# Altium schematic sheet Board_C22.SchDoc: Chicken Board C22
size A3; Organization: Pay It Forward club; Address2: 304B1; Address4: HCMUT; DocumentNumber: 1; Revision: 3; SheetNumber: 1; SheetTotal: 1
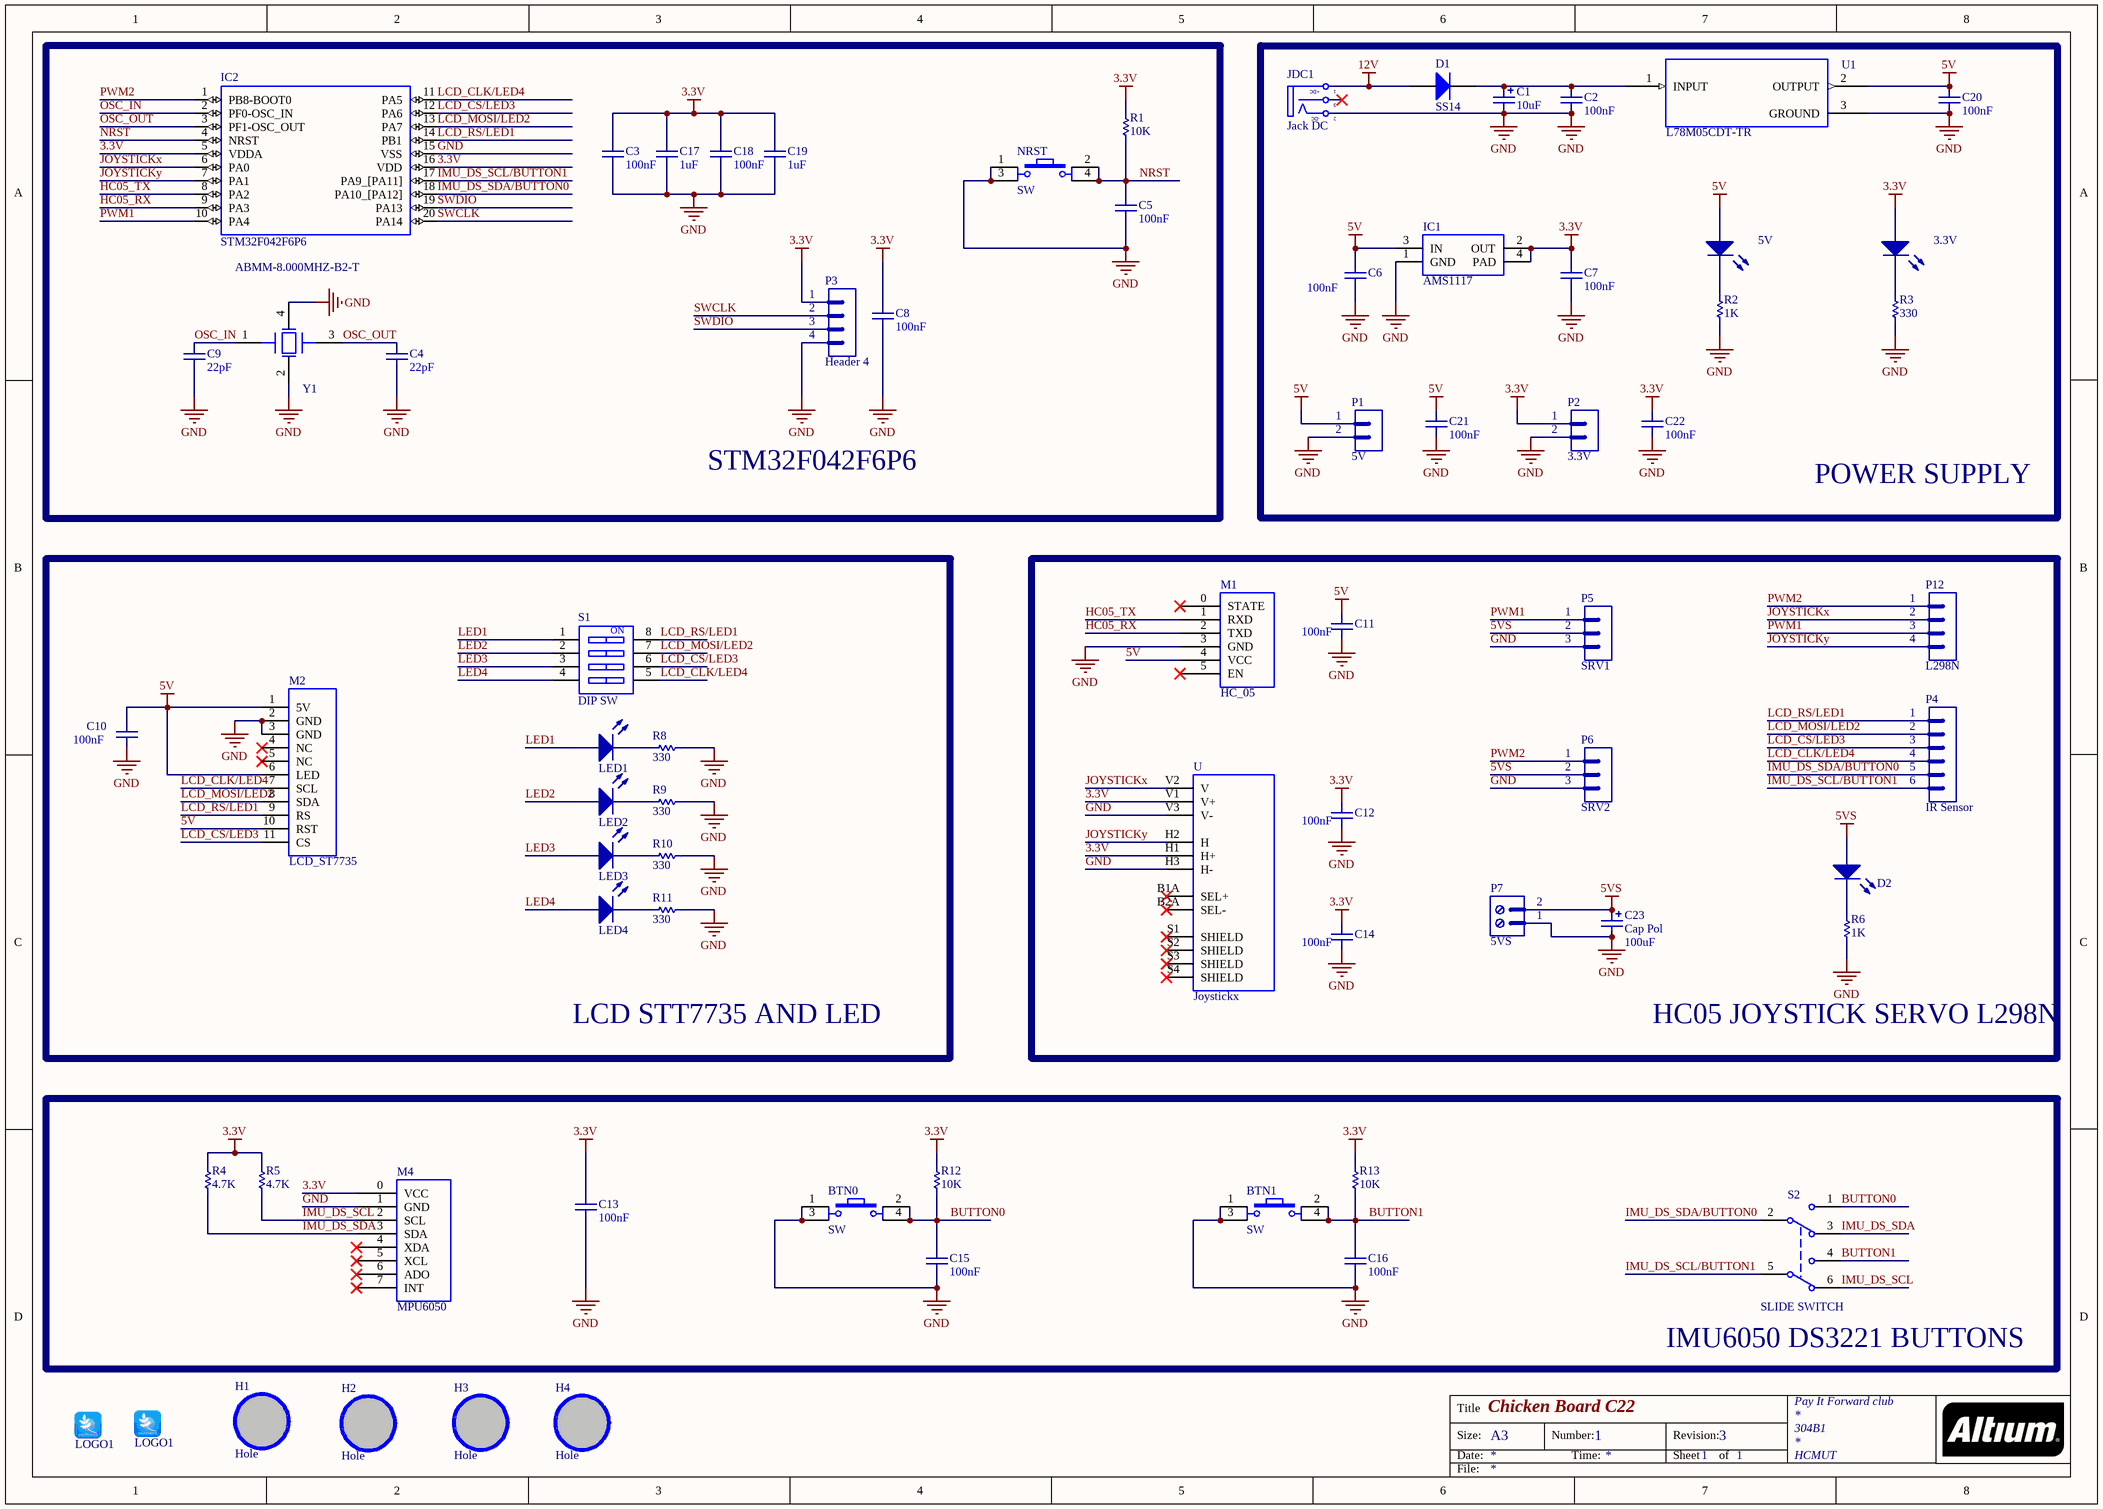
[diagram p0: Board_C22.SchDoc]

## Parts
(Parts that share a designator on the sheet are numbered #1, #2 ... from top to bottom, then left to right.)
3.3V  LED  [LED_0805_Blue]  (value not drawn)
5V  LED  [LED_0805_Blue]  (value not drawn)
BTN0  SW  [4301x60437x6]
BTN1  SW  [4301x60437x6]
C1  Capacitance: 10uF  [C_TANTALUM_3216_18]  (hidden comment: Capacitors)
C2  value 100nF  [CAP-SM-0805]  (hidden comment: Cap Non-Pol SMD)
C3  value 100nF  [CAP-SM-0805]  (hidden comment: Cap Non-Pol SMD)
C4  value 22pF  [CAP-SM-0805]  (hidden comment: Cap Non-Pol SMD)
C5  value 100nF  [CAP-SM-0805]  (hidden comment: Cap Non-Pol SMD)
C6  value 100nF  [CAP-SM-0805]  (hidden comment: Cap Non-Pol SMD)
C7  value 100nF  [CAP-SM-0805]  (hidden comment: Cap Non-Pol SMD)
C8  value 100nF  [CAP-SM-0805]  (hidden comment: Cap Non-Pol SMD)
C9  value 22pF  [CAP-SM-0805]  (hidden comment: Cap Non-Pol SMD)
C10  value 100nF  [CAP-SM-0805]  (hidden comment: Cap Non-Pol SMD)
C11  value 100nF  [CAP-SM-0805]  (hidden comment: Cap Non-Pol SMD)
C12  value 100nF  [CAP-SM-0805]  (hidden comment: Cap Non-Pol SMD)
C13  value 100nF  [CAP-SM-0805]  (hidden comment: Cap Non-Pol SMD)
C14  value 100nF  [CAP-SM-0805]  (hidden comment: Cap Non-Pol SMD)
C15  value 100nF  [CAP-SM-0805]  (hidden comment: Cap Non-Pol SMD)
C16  value 100nF  [CAP-SM-0805]  (hidden comment: Cap Non-Pol SMD)
C17  value 1uF  [CAP-SM-0805]  (hidden comment: Cap Non-Pol SMD)
C18  value 100nF  [CAP-SM-0805]  (hidden comment: Cap Non-Pol SMD)
C19  value 1uF  [CAP-SM-0805]  (hidden comment: Cap Non-Pol SMD)
C20  value 100nF  [CAP-SM-0805]  (hidden comment: Cap Non-Pol SMD)
C21  value 100nF  [CAP-SM-0805]  (hidden comment: Cap Non-Pol SMD)
C22  value 100nF  [CAP-SM-0805]  (hidden comment: Cap Non-Pol SMD)
C23  Cap Pol  value 100uF  [CP1/2.5]
D1  SS14  [SS14]
D2  LED  [LED_0805_Blue]  (value not drawn)
H1  Hole  [LO KHOAN 3MM]
H2  Hole  [LO KHOAN 3MM]
H3  Hole  [LO KHOAN 3MM]
H4  Hole  [LO KHOAN 3MM]
IC1  AMS1117  [SOT223]
IC2  STM32F042F6P6  [TSSOP20]
JDC1  Jack DC  [DC-IN]
LED1  LED  [LED_0805_Blue]  (value not drawn)
LED2  LED  [LED_0805_Blue]  (value not drawn)
LED3  LED  [LED_0805_Blue]  (value not drawn)
LED4  LED  [LED_0805_Blue]  (value not drawn)
LOGO1#1  LOGO PIF  [PIF LOGO TOP OVERLAY]  (value not drawn)
LOGO1#2  LOGO PIF  [PIF LOGO BOTTOM OVERLAY]  (value not drawn)
M1  HC_05  [HC_05]
M2  LCD_ST7735  [LCD_ST7735]
M4  MPU6050  [GY521_MPU6050]
NRST  SW  [4301x60437x6]
P1  5V  [JP2]
P2  3.3V  [JP2]
P3  Header 4  [JP4]
P4  IR Sensor  [JP6]
P5  SRV1  [JP3]
P6  SRV2  [JP3]
P7  5VS  [DOMINO SMALL 2]
P12  L298N  [JP4]
R1  value 10K  [RES-SM-0805]  (hidden comment: Resistor 1/4W)
R2  value 1K  [RES-SM-0805]  (hidden comment: Resistor 1/4W)
R3  value 330  [RES-SM-0805]  (hidden comment: Resistor 1/4W)
R4  value 4.7K  [RES-SM-0805]  (hidden comment: Resistor 1/4W)
R5  value 4.7K  [RES-SM-0805]  (hidden comment: Resistor 1/4W)
R6  value 1K  [RES-SM-0805]  (hidden comment: Resistor 1/4W)
R8  value 330  [RES-SM-0805]  (hidden comment: Resistor 1/4W)
R9  value 330  [RES-SM-0805]  (hidden comment: Resistor 1/4W)
R10  value 330  [RES-SM-0805]  (hidden comment: Resistor 1/4W)
R11  value 330  [RES-SM-0805]  (hidden comment: Resistor 1/4W)
R12  value 10K  [RES-SM-0805]  (hidden comment: Resistor 1/4W)
R13  value 10K  [RES-SM-0805]  (hidden comment: Resistor 1/4W)
S1  DIP SW  [418117270904]
S2  SLIDE SWITCH  [452404020202]
U  Joystickx  [XDCR_COM-09032]
U1  L78M05CDT-TR  [DPAK_STM]
Y1  ABMM-8.000MHZ-B2-T  [XTAL_TSX-3225_16.0000MF18X-AC3]

## Nets
3.3V: 3.3V.1(A) C3.2 C7.2 C8.2 C12.2 C13.2 C14.2 C17.2 C18.2 C19.2 C22.2 IC1.2(OUT) IC1.4(PAD) IC2.5(VDDA) IC2.16(VDD) M4.0(VCC) P2.1 P3.1 R1.2 R4.2 R5.2 R12.2 R13.2 U.H1(H+) U.V1(V+)
5V: 5V.1(A) C6.2 C10.2 C11.2 C20.1 C21.2 IC1.3(IN) M1.4(VCC) M2.1(5V) M2.6(LED) M2.10(RST) P1.1 U1.2(OUTPUT)
5VS: C23.1 D2.1(A) P5.2 P6.2 P7.2
12V: D1.1(A) JDC1.1(T)
GND: BTN0.1 BTN0.3 BTN1.1 BTN1.3 C1.2 C2.1 C3.1 C4.1 C5.1 C6.1 C7.1 C8.1 C9.2 C10.1 C11.1 C12.1 C13.1 C14.1 C15.1 C16.1 C17.1 C18.1 C19.1 C20.2 C21.1 C22.1 C23.2 IC1.1(GND) IC2.15(VSS) JDC1.2(TN) M1.3(GND) M2.2(GND) M2.3(GND) M4.1(GND) NRST.1 NRST.3 P1.2 P2.2 P3.4 P5.3 P6.3 P7.1 R2.1 R3.1 R6.1 R8.1 R9.1 R10.1 R11.1 U.H3(H-) U.V3(V-) U1.3(GROUND) Y1.2 Y1.4
BUTTON0: BTN0.2 BTN0.4 C15.2 R12.1 S2.1
BUTTON1: BTN1.2 BTN1.4 C16.2 R13.1 S2.4
HC05_RX: IC2.9(PA3) M1.2(TXD)
HC05_TX: IC2.8(PA2) M1.1(RXD)
IMU_DS_SCL: M4.2(SCL) R5.1 S2.6
IMU_DS_SCL/BUTTON1: IC2.17(PA9_[PA11]) P4.6 S2.5(COM)
IMU_DS_SDA: M4.3(SDA) R4.1 S2.3
IMU_DS_SDA/BUTTON0: IC2.18(PA10_[PA12]) P4.5 S2.2(COM)
JOYSTICKx: IC2.6(PA0) P12.2 U.V2(V)
JOYSTICKy: IC2.7(PA1) P12.4 U.H2(H)
LCD_CLK/LED4: IC2.11(PA5) M2.7(SCL) P4.4 S1.5
LCD_CS/LED3: IC2.12(PA6) M2.11(CS) P4.3 S1.6
LCD_MOSI/LED2: IC2.13(PA7) M2.8(SDA) P4.2 S1.7
LCD_RS/LED1: IC2.14(PB1) M2.9(RS) P4.1 S1.8
LED1: LED1.1(A) S1.1
LED2: LED2.1(A) S1.2
LED3: LED3.1(A) S1.3
LED4: LED4.1(A) S1.4
NRST: C5.2 IC2.4(NRST) NRST.2 NRST.4 R1.1
OSC_IN: C9.1 IC2.2(PF0-OSC_IN) Y1.1
OSC_OUT: C4.2 IC2.3(PF1-OSC_OUT) Y1.3
PWM1: IC2.10(PA4) P5.1 P12.3
PWM2: IC2.1(PB8-BOOT0) P6.1 P12.1
SWCLK: IC2.20(PA14) P3.2
SWDIO: IC2.19(PA13) P3.3
Net3.3V_2: 3.3V.2(K) R3.2
Net5V_2: 5V.2(K) R2.2
NetC1_1: C1.1 C2.2 D1.2(K) U1.1(INPUT)
NetD2_2: D2.2(K) R6.2
NetLED1_2: LED1.2(K) R8.2
NetLED2_2: LED2.2(K) R9.2
NetLED3_2: LED3.2(K) R10.2
NetLED4_2: LED4.2(K) R11.2

Not connected (* = marked no-connect by the designer): H1 1; H2 1; H3 1; H4 1; JDC1 3(S)*; M1 0(STATE)* 5(EN)*; M2 4(NC)* 5(NC)*; M4 4(XDA)* 5(XCL)* 6(ADO)* 7(INT)*; U B1A(SEL+)* B2A(SEL-)* S1(SHIELD)* S2(SHIELD)* S3(SHIELD)* S4(SHIELD)*

## Notes on the sheet
- STM32F042F6P6
- POWER SUPPLY
- LCD STT7735 AND LED
- HC05 JOYSTICK SERVO L298N
- (near S2) IMU6050 DS3221 BUTTONS
- Title
- Size:
- Date:
- A3
- Number:
- Time:
- Revision:
- Sheet
- of
- File:
- (in symbol DIP SW) ON
- (in symbol Jack DC) +DC; -DC

## Library data of the parts
BTN0 BTN1 NRST = SW4: Switch button 4 pin; Value: Button chip 4 pin
C1 = Cap Pol Tantalum: Capacitors Tantalum; Manufacturer: Kemet; Manufacturer Part Number: T491A106K010AT; Manufacturer Size Code: A; Tolerance: ±10%; Voltage - Rated: 10V; ESR (Equivalent Series Resistance): 3.8 Ohm; Type: Molded; Lifetime @ Temp.: 2000 Hrs @ 85°C; Supplier 1: Digi-Key; RoHS: RoHS Compliant; Category: Capacitors; Stock 1: 316000; Pricing 1: 2000=0.0626, 4000=0.05791, 10000=0.05478, 14000=0.05196, 50000=0.04695, 100000=0.04147 (USD); Packaging: Tape & Reel (TR); Part Status: Active; Operating Temperature: -55°C ~ 125°C; Mounting Type: Surface Mount; Package / Case: 1206 (3216 Metric); Size / Dimension: 0.126" L x 0.063" W (3.20mm x 1.60mm); Height - Seated (Max): 0.071" (1.80mm); Lead Spacing: -; Features: General Purpose; ComponentLink1URL: http://www.kemet.com/Lists/ProductCatalog/Attachments/254/KEM_T2005_T491.pdf; ComponentLink1Description: http://www.kemet.com/Lists/ProductCatalog/Attachments/254/KEM_T2005_T491.pdf
C2-C22 = Cap Non-Pol SMD: Capacitor
C23 = Cap Pol: Polarized Capacitor (Radial)
D1 = Diode-SS14: DIODE SCHOTTKY 40V 1A SMA; Manufacturer: ON Semiconductor; Local Supplier: thegioiic; Local Supplier Link: https://thegioiic.com/products/ss14-sma; Supplier 1: Digikey; Supplier 1 Link: https://www.digikey.com/product-detail/en/on-semiconductor/SS14/SS14CT-ND/965729; Manufacturer Part Number: SS14; Supplier 1 Part Number: SS14CT-ND
H1-H4 = Hole: Hole 3mm
IC1 = AMS1117: Available in 1.8V, 2.5V, 2.85V, 3.3V, 5V, and  Adjustable Versions; Value: LM317
IC2 = STM32F042F6P6: ARMÂ® CortexÂ®-M0 STM32F0 Microcontroller IC 32-Bit 48MHz 32KB _32K x 8_ FLASH 20-TSSOP; MF: STMicroelectronics; Availability: Unavailable; SnapEDA_Link: https://www.snapeda.com/parts/STM32F042F6P6/STMicroelectronics/view-part/109253/?ref=snap; MP: STM32F042F6P6; Value: *; Price: None; Package: TSSOP-20 STMicroelectronics
JDC1 = Jack DC: Jack DC input; Value: Jac DC
M4 = GY521_MPU6050
P1 P2 = Header 2: Header, 2-Pin; LatestRevisionDate: 17-Jul-2002; LatestRevisionNote: Re-released for DXP Platform.; Publisher: Altium Limited
P3 P12 = Header 4: Header, 4-Pin; LatestRevisionDate: 17-Jul-2002; LatestRevisionNote: Re-released for DXP Platform.; Publisher: Altium Limited
P4 = Header 6: Header, 6-Pin; LatestRevisionDate: 17-Jul-2002; LatestRevisionNote: Re-released for DXP Platform.; Publisher: Altium Limited
P5 P6 = Header 3: Header, 3-Pin; LatestRevisionDate: 17-Jul-2002; LatestRevisionNote: Re-released for DXP Platform.; Publisher: Altium Limited
P7 = Domino 2: Domino, 2-Pin; LatestRevisionDate: 17-Jul-2002; LatestRevisionNote: Re-released for DXP Platform.; Publisher: Altium Limited
R1-R6 R8-R13 = RES
S1 = DIP SW: WS-DITV Compact THT Dip Switch, Raised Actuator, pitch 2.54mm, 4p; Operation Force: 800g; Pole Number: 4; Actuator Type: Raise Type; Circuit: SPST-NO; Rated Current Switching: 25mA; Rated Current Non-Switching: 100mA; Rated Voltage Non-Switching: 50VDC; Rated Voltage Switching: 24VDC; ComponentLink1Description: Manufacturer; ComponentLink1URL: http://www.we-online.de; ComponentLink2Description: Datasheet; ComponentLink2URL: https://katalog.we-online.com/em/datasheet/418117270904.pdf; Pitch: 2.54mm; Contact Material: Copper Alloy; Mounting Technology: THT; Operating Temperature: -40 to +85degC; Contact Plating: Gold; Packaging: Tube; Part Number: 418117270904; Publisher: Wurth Elektronik; Published Date: September 2019
S2 = SW: WS-SLTV THT Mini Slide Switch, Same Side Connection, DPDT; Rated Current: 300mA; Rated Voltage: 6VDC; Switching Function: On-On; ComponentLink1Description: Manufacturer; ComponentLink1URL: http://www.we-online.de; ComponentLink2Description: Datasheet; ComponentLink2URL: https://katalog.we-online.com/em/datasheet/452404020202.pdf; Packaging: Bulk; Publisher: Wurth Elektronik; Contact Material: Copper Alloy; Mounting Technology: THT; Operating Temperature: -40 to +85degC; Contact Plating: Silver; Part Number: 452404020202; Published Date: September 2019; Terminal Material: Copper Alloy; Size: 9x3.5mm; Circuit: DPDT; Terminal Plating: Silver
U = Joystickx: Joystick, 2 - Axis Analog _Resistive_ Output; MF: SparkFun Electronics; MP: COM-09032; SnapEDA_Link: https://www.snapeda.com/parts/COM-09032/SparkFun%20Electronics/view-part/888157/?ref=snap; Availability: Unavailable; Value: *; Price: None; Package: SparkFun Electronics
U1 = L78M05CDT-TR: No Description Available; SourceLibrary: PartsWith3DErrors_Fixed; Built_By: EMA_UL_Team; Vendor: STMicroelectronics; Manufacturer_Part_Number: L78M05CDT-TR; Copyright: Copyright (C) 2018 Accelerated Designs. All rights reserved; RefDes: RefDes; Type: DEV
Y1 = ABMM-8.000MHZ-B2-T: 8MHz Â±20ppm Crystal 18pF 70 Ohms 4-SMD, No Lead; MF: Abracon; Package: SMD-4 Abracon; Digi-Key_Purchase_URL: https://www.digikey.com/product-detail/en/abracon-llc/ABMM-8.000MHZ-B2-T/535-9164-1-ND/675681?utm_source=snapeda&utm_medium=aggregator&utm_campaign=symbol; MP: ABMM-8.000MHZ-B2-T; Value: *; SnapEDA_Link: https://www.snapeda.com/parts/ABMM-8.000MHZ-B2-T/Abracon%20LLC/view-part/106768/?ref=snap; Digi-Key_Part_Number: 535-9164-1-ND